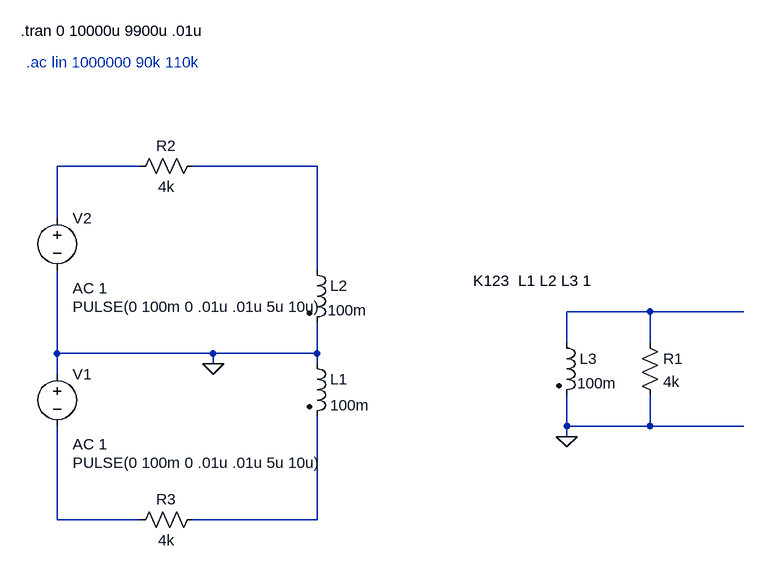
[diagram p0: schematic autotrafo2.asc]
autotrafo2.asc, the LTspice schematic file:
Version 4
SHEET 1 896 680
WIRE -96 -208 -224 -208
WIRE 176 -208 -16 -208
WIRE -224 -128 -224 -208
WIRE 176 -48 176 -208
WIRE 688 16 560 16
WIRE 832 16 688 16
WIRE 560 64 560 16
WIRE 688 64 688 16
WIRE -224 80 -224 -48
WIRE 16 80 -224 80
WIRE 176 80 176 32
WIRE 176 80 16 80
WIRE 16 96 16 80
WIRE 176 96 176 80
WIRE -224 112 -224 80
WIRE 560 192 560 144
WIRE 688 192 688 144
WIRE 688 192 560 192
WIRE 832 192 688 192
WIRE 560 208 560 192
WIRE -224 336 -224 192
WIRE -96 336 -224 336
WIRE 176 336 176 176
WIRE 176 336 -16 336
FLAG 560 208 0
FLAG 16 96 0
SYMBOL ind2 160 80 R0
SYMATTR InstName L1
SYMATTR Value 100m
SYMBOL ind2 160 -64 R0
WINDOW 3 32 78 Left 2
SYMATTR Value 100m
SYMATTR InstName L2
SYMBOL ind2 544 48 R0
WINDOW 3 32 78 Left 2
SYMATTR Value 100m
SYMATTR InstName L3
SYMBOL voltage -224 -144 R0
WINDOW 123 24 124 Left 2
WINDOW 39 0 0 Left 2
WINDOW 3 24 152 Left 2
SYMATTR Value2 AC 1
SYMATTR Value PULSE(0 100m 0 .01u .01u 5u 10u)
SYMATTR InstName V2
SYMBOL res 672 48 R0
SYMATTR InstName R1
SYMATTR Value 4k
SYMBOL res 0 -224 R90
WINDOW 0 0 56 VBottom 2
WINDOW 3 32 56 VTop 2
SYMATTR InstName R2
SYMATTR Value 4k
SYMBOL res 0 320 R90
WINDOW 0 0 56 VBottom 2
WINDOW 3 32 56 VTop 2
SYMATTR InstName R3
SYMATTR Value 4k
SYMBOL voltage -224 96 R0
WINDOW 123 24 124 Left 2
WINDOW 39 0 0 Left 2
WINDOW 3 24 152 Left 2
SYMATTR Value2 AC 1
SYMATTR Value PULSE(0 100m 0 .01u .01u 5u 10u)
SYMATTR InstName V1
TEXT -272 -368 Left 2 ;.ac lin 1000000 90k 110k
TEXT 416 -32 Left 2 !K123  L1 L2 L3 1
TEXT -280 -416 Left 2 !.tran 0 10000u 9900u .01u

The netlist it stands for:
* autotrafo2.asc
L1 0 N005 100m
L2 N002 0 100m
L3 N003 0 100m
V2 N001 0 PULSE(0 100m 0 .01u .01u 5u 10u) AC 1
R1 N003 0 4k
R2 N002 N001 4k
R3 N005 N004 4k
V1 0 N004 PULSE(0 100m 0 .01u .01u 5u 10u) AC 1
* .ac lin 1000000 90k 110k
K123  L1 L2 L3 1
.tran 0 10000u 9900u .01u
.backanno
.end